# Altium schematic sheet SLT3-PAY-1Q2T_P1.SchDoc: SVPXFMC Carrier 3U
size A4; CheckedBy: \; Author: G.Kasprowicz; CompanyName: ISE; DrawnBy: T.Przywozki; Organization: WUT ISE; Address1: Warsaw University of Technology; Address2: Nowowiejska 15/19 00-665 Warsaw; Revision: 1.0.; SheetNumber: 13; SheetTotal: 20; Project: SVPXFMC Carrier 3U; ModifiedBy: -; CheckedDate: -; Title2: SpaceVPX P1, SLT3-PAY-1Q2T; DivGrp: ISE; Designer: G. Kasprowicz
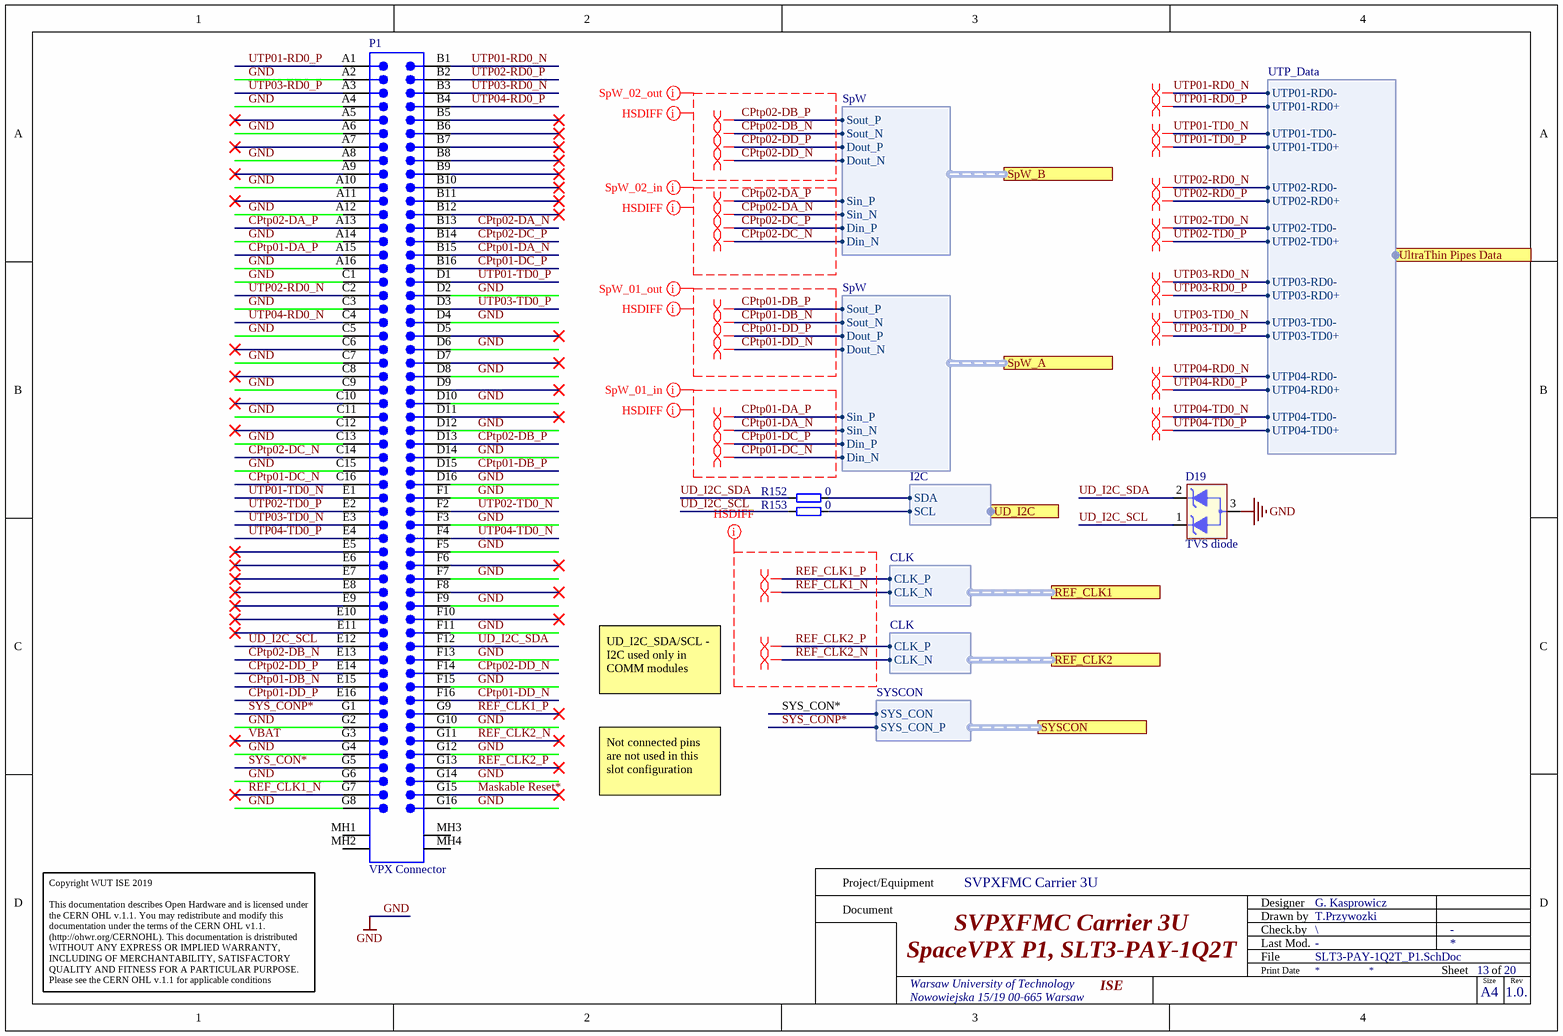
[diagram p0: SLT3-PAY-1Q2T_P1.SchDoc]

## Parts
D19  TVS diode  [SOT-723_(ESD7C3.3DT5G)]
P1  VPX Connector  [BTB1-8-4H112M]
R152  0  [RESC0603X28N]
R153  0  [RESC0603X28N]

## Ports
REF_CLK1 (harness CLK), REF_CLK2 (harness CLK), SpW_A (harness SpW), SpW_B (harness SpW), SYSCON (harness SYSCON), UD_I2C (harness I2C), UltraThin Pipes Data (harness UTP_Data)

## Harnesses
SpW: Sout_P, Sout_N, Dout_P, Dout_N, Sin_P, Sin_N, Din_P, Din_N
CLK: CLK_P, CLK_N
SYSCON: SYS_CON, SYS_CON_P
I2C: SDA, SCL
UTP_Data: UTP01-RD0-, UTP01-RD0+, UTP01-TD0-, UTP01-TD0+, UTP02-RD0-, UTP02-RD0+, UTP02-TD0-, UTP02-TD0+, UTP03-RD0-, UTP03-RD0+, UTP03-TD0-, UTP03-TD0+, UTP04-RD0-, UTP04-RD0+, UTP04-TD0-, UTP04-TD0+

## Nets
GND: D19.3 P1.A2 P1.A4 P1.A6 P1.A8 P1.A10 P1.A12 P1.A14 P1.A16 P1.C1 P1.C3 P1.C5 P1.C7 P1.C9 P1.C11 P1.C13 P1.C15 P1.D2 P1.D4 P1.D6 P1.D8 P1.D10 P1.D12 P1.D14 P1.D16 P1.F1 P1.F3 P1.F5 P1.F7 P1.F9 P1.F11 P1.F13 P1.F15 P1.G2 P1.G4 P1.G6 P1.G8 P1.G10 P1.G12 P1.G14 P1.G16
CPtp01-DA_N: P1.B15 ; port SpW_A.Sin_N
CPtp01-DA_P: P1.A15 ; port SpW_A.Sin_P
CPtp01-DB_N: P1.E15 ; port SpW_A.Sout_N
CPtp01-DB_P: P1.D15 ; port SpW_A.Sout_P
CPtp01-DC_N: P1.C16 ; port SpW_A.Din_N
CPtp01-DC_P: P1.B16 ; port SpW_A.Din_P
CPtp01-DD_N: P1.F16 ; port SpW_A.Dout_N
CPtp01-DD_P: P1.E16 ; port SpW_A.Dout_P
CPtp02-DA_N: P1.B13 ; port SpW_B.Sin_N
CPtp02-DA_P: P1.A13 ; port SpW_B.Sin_P
CPtp02-DB_N: P1.E13 ; port SpW_B.Sout_N
CPtp02-DB_P: P1.D13 ; port SpW_B.Sout_P
CPtp02-DC_N: P1.C14 ; port SpW_B.Din_N
CPtp02-DC_P: P1.B14 ; port SpW_B.Din_P
CPtp02-DD_N: P1.F14 ; port SpW_B.Dout_N
CPtp02-DD_P: P1.E14 ; port SpW_B.Dout_P
Maskable Reset*: P1.G15
REF_CLK1_N: P1.G7 ; port REF_CLK1.CLK_N
REF_CLK1_P: P1.G9 ; port REF_CLK1.CLK_P
REF_CLK2_N: P1.G11 ; port REF_CLK2.CLK_N
REF_CLK2_P: P1.G13 ; port REF_CLK2.CLK_P
SYS_CON*: P1.G5 ; port SYSCON.SYS_CON
SYS_CONP*: P1.G1 ; port SYSCON.SYS_CON_P
UD_I2C_SCL: D19.1 P1.E12 R153.1
UD_I2C_SDA: D19.2 P1.F12 R152.1
UTP01-RD0_N: P1.B1 ; port UltraThin Pipes Data.UTP01-RD0-
UTP01-RD0_P: P1.A1 ; port UltraThin Pipes Data.UTP01-RD0+
UTP01-TD0_N: P1.E1 ; port UltraThin Pipes Data.UTP01-TD0-
UTP01-TD0_P: P1.D1 ; port UltraThin Pipes Data.UTP01-TD0+
UTP02-RD0_N: P1.C2 ; port UltraThin Pipes Data.UTP02-RD0-
UTP02-RD0_P: P1.B2 ; port UltraThin Pipes Data.UTP02-RD0+
UTP02-TD0_N: P1.F2 ; port UltraThin Pipes Data.UTP02-TD0-
UTP02-TD0_P: P1.E2 ; port UltraThin Pipes Data.UTP02-TD0+
UTP03-RD0_N: P1.B3 ; port UltraThin Pipes Data.UTP03-RD0-
UTP03-RD0_P: P1.A3 ; port UltraThin Pipes Data.UTP03-RD0+
UTP03-TD0_N: P1.E3 ; port UltraThin Pipes Data.UTP03-TD0-
UTP03-TD0_P: P1.D3 ; port UltraThin Pipes Data.UTP03-TD0+
UTP04-RD0_N: P1.C4 ; port UltraThin Pipes Data.UTP04-RD0-
UTP04-RD0_P: P1.B4 ; port UltraThin Pipes Data.UTP04-RD0+
UTP04-TD0_N: P1.F4 ; port UltraThin Pipes Data.UTP04-TD0-
UTP04-TD0_P: P1.E4 ; port UltraThin Pipes Data.UTP04-TD0+
VBAT: P1.G3
NetR152_2: R152.2 ; port UD_I2C.SDA
NetR153_2: R153.2 ; port UD_I2C.SCL

Not connected (* = marked no-connect by the designer): P1 A5* A7* A9* A11* B5* B6* B7* B8* B9* B10* B11* B12* C6* C8* C10* C12* D5* D7* D9* D11* E5* E6* E7* E8* E9* E10* E11* F6* F8* F10* MH1 MH2 MH3 MH4

## Layout directives
differential pair: CPtp01-DA_N, CPtp01-DA_P, CPtp01-DB_N, CPtp01-DB_P, CPtp01-DC_N, CPtp01-DC_P, CPtp01-DD_N, CPtp01-DD_P, CPtp02-DA_N, CPtp02-DA_P, CPtp02-DB_N, CPtp02-DB_P, CPtp02-DC_N, CPtp02-DC_P, CPtp02-DD_N, CPtp02-DD_P, REF_CLK1_N, REF_CLK1_P, REF_CLK2_N, REF_CLK2_P, UTP01-RD0_N, UTP01-RD0_P, UTP01-TD0_N, UTP01-TD0_P, UTP02-RD0_N, UTP02-RD0_P, UTP02-TD0_N, UTP02-TD0_P, UTP03-RD0_N, UTP03-RD0_P, UTP03-TD0_N, UTP03-TD0_P, UTP04-RD0_N, UTP04-RD0_P, UTP04-TD0_N, UTP04-TD0_P
net class SpW_02_out: CPtp02-DB_N, CPtp02-DB_P, CPtp02-DD_N, CPtp02-DD_P
net class SpW_02_in: CPtp02-DA_N, CPtp02-DA_P, CPtp02-DC_N, CPtp02-DC_P
net class SpW_01_out: CPtp01-DB_N, CPtp01-DB_P, CPtp01-DD_N, CPtp01-DD_P
net class SpW_01_in: CPtp01-DA_N, CPtp01-DA_P, CPtp01-DC_N, CPtp01-DC_P
net class HSDIFF: CPtp01-DA_N, CPtp01-DA_P, CPtp01-DB_N, CPtp01-DB_P, CPtp01-DC_N, CPtp01-DC_P, CPtp01-DD_N, CPtp01-DD_P, CPtp02-DA_N, CPtp02-DA_P, CPtp02-DB_N, CPtp02-DB_P, CPtp02-DC_N, CPtp02-DC_P, CPtp02-DD_N, CPtp02-DD_P, REF_CLK1_N, REF_CLK1_P, REF_CLK2_N, REF_CLK2_P

## Notes on the sheet
- UD_I2C_SDA/SCL - I2C used only in COMM modules
- Not connected pins are not used in this slot configuration
- Project/Equipment
- Document
- Designer
- Drawn by
- Check.by
- Copyright WUT ISE 2019
  This documentation describes Open Hardware and is licensed under the CERN OHL v.1.1. You may redistribute and modify this documentation under the terms of the CERN OHL v1.1.
  (http://ohwr.org/CERNOHL). This documentation is dristributed WITHOUT ANY EXPRESS OR IMPLIED WARRANTY, INCLUDING OF MERCHANTABILITY, SATISFACTORY QUALITY AND FITNESS FOR A PARTICULAR PURPOSE. Please see the CERN OHL v.1.1 for applicable conditions
- File
- Last Mod.
- Print Date
- Sheet
- Size
- A4
- of
- Rev

## Library data of the parts
D19 = ESD7C3.3DT5G: Dual TVS diode, Vrwm=3.3V; Manufacturer: ON Semiconductor; Bonding: No; ComponentHeigth: 0.5mm; PressFit: No; Value: 3.3V; Case: SOT-723; Component Kind: Standard; Component Type: Standard; CreateDate: 2018-06-18; Device: TVS diode; HelpURL: https://www.onsemi.com/pub/Collateral/ESD7C3.3D-D.PDF; LatestRevisionDate: 2018-06-18; Manufacturer Part Number: ESD7C3.3DT5G; Mounted: Yes; PackageDescription: SOT-723; Part Description: TVS diode; Part Number: ESD7C3.3DT5G; Pin Count: 3; Sense: No; SMD: Yes; Socket: No
P1 = 2102771-1: Ruggedized Board-to-Board Connector, Right Angle, 7-Row, Pitch 1.8mm, 112-Position; Manufacturer: TE; Bonding: No; ComponentHeigth: 14.7mm; PressFit: No; Case: *; Component Kind: Standard; Component Type: Standard; CreateDate: 2018-01-01; Device: *; Footprint: *; HelpURL: *; LatestRevisionDate: 2018-01-01; Manufacturer Part Number: 2102771-1; Mounted: Yes; PackageDescription: 2102771-1; Part Description: Ruggedized Board-to-Board Connector, Right Angle, 7-Row, Pitch 1.8mm, 112-Position; Part Number: 2102771-1; Pin Count: *; Sense: No; SMD: Yes; Socket: No; Family: VPX Connector
R152 R153 = R0201_0R_JUMPER: Resistor; Part Description: 1A (0.05R Max DC Resistance) Zero Ohm Jumper; Manufacturer: GENERIC; Manufacturer1 Part Number: CRCW02010000Z0ED; PressFit: No; Part Number: R0201_0R_JUMPER; Component Kind: Standard; Component Type: Standard; Pin Count: 2; Value: 0; Status: Not Recommended; Manufacturer Part Number: R0201_0R_JUMPER; Case: 0201; Mounted: Yes; Sense: No; Socket: No; SMD: Yes; Manufacturer1 Example: VISHAY; Manufacturer1 ComponentHeight: 0.27mm; HelpURL: \\cern.ch\dfs\Applications\Altium\Datasheets\R0201_VISHAY_CRCW e3.pdf; Author: CERN DEM JLC; CreateDate: 19.11.2014; LatestRevisionDate: 08.01.2015